# EAGLE design AetherMesh Test Fixture LGA V1.0 (EAGLE 8.3.1)
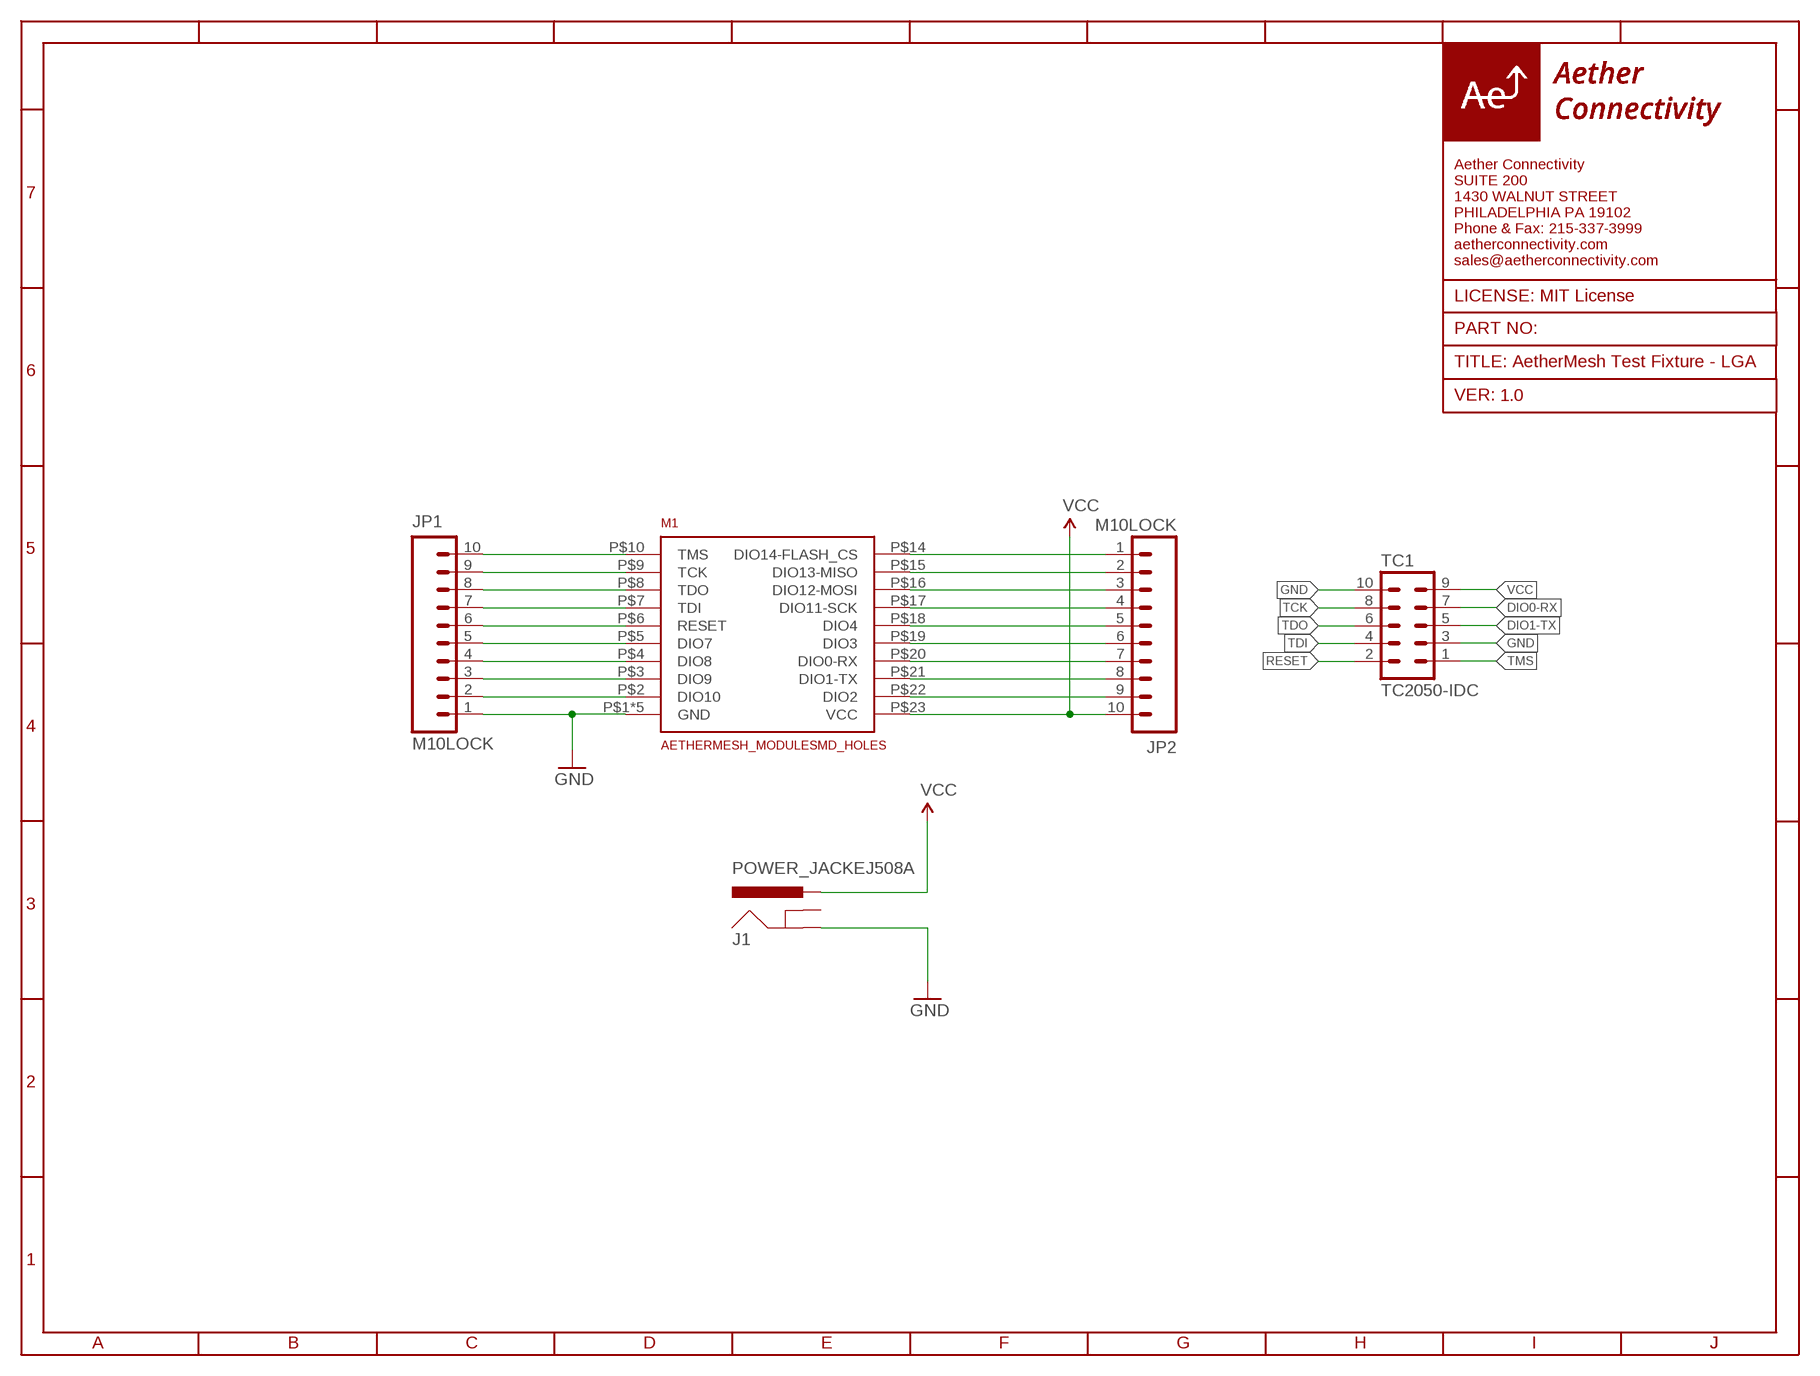
[diagram p0: schematic, sheet 1]

## Parts
J1  POWER_JACKEJ508A  [DC_JACK_EJ508A]
JP1  M10LOCK  [1X10_LOCK]
JP2  M10LOCK  [1X10_LOCK]
M1  AETHERMESH_MODULESMD_HOLES  [AETHERMESH_SMD_MOUNT_HOLES]
TC1  TC2050-IDC  [TC2050-IDC]

## Nets
BUTTON: JP1.2 M1.P$2(DIO10)
CS: JP1.5 M1.P$5(DIO7)
DIO0-RX: JP2.7 M1.P$20(DIO0-RX) TC1.7
DIO1-TX: JP2.8 M1.P$21(DIO1-TX) TC1.5
DIO2: JP2.9 M1.P$22(DIO2)
DIO3: JP2.6 M1.P$19(DIO3)
DIO4: JP2.5 M1.P$18(DIO4)
ENC_RESET: JP1.4 M1.P$4(DIO8)
GND: J1.1(GND) JP1.1 M1.P$1(GND) M1.P$11(GND) M1.P$12(GND) M1.P$13(GND) M1.P$24(GND) TC1.3 TC1.10
INT: JP1.3 M1.P$3(DIO9)
MISO: JP2.2 M1.P$15(DIO13-MISO)
MOSI: JP2.3 M1.P$16(DIO12-MOSI)
N$1: JP2.1 M1.P$14(DIO14-FLASH_CS)
RESET: JP1.6 M1.P$6(RESET) TC1.2
SCK: JP2.4 M1.P$17(DIO11-SCK)
TCK: JP1.9 M1.P$9(TCK) TC1.8
TDI: JP1.7 M1.P$7(TDI) TC1.4
TDO: JP1.8 M1.P$8(TDO) TC1.6
TMS: JP1.10 M1.P$10(TMS) TC1.1
VCC: J1.3(PWR) JP2.10 M1.P$23(VCC) TC1.9
Unconnected: J1.2(GNDBREAK)

## Notes on the sheet
- AetherMesh Test Fixture - LGA
- 1.0

## Library data of the parts
J1 = 3. growflux:POWER_JACK: Power Jack This is the standard 5.5mm barrel jack for power. The PTH is the most common, proven, reliable, footprint. The Slot footprint only works if the mill layer is transmitted to the PCB fab house so be warned. Mating wall wart : TOL-00298 (and others)
JP1 JP2 = 3. growflux:M10: Header 10 Standard 10-pin 0.1" header. Use with straight break away headers (SKU : PRT-00116), right angle break away headers (PRT-00553), swiss pins (PRT-00743), machine pins (PRT-00117), and female headers (PRT-00115).
M1 = AetherConnectivity:AETHERMESH_MODULE
TC1 = TagConnect:TC2050-IDC: Tag-Connect In Circuit Programming & Debug Cable 10 Pin http://www.tag-connect.com

## Board
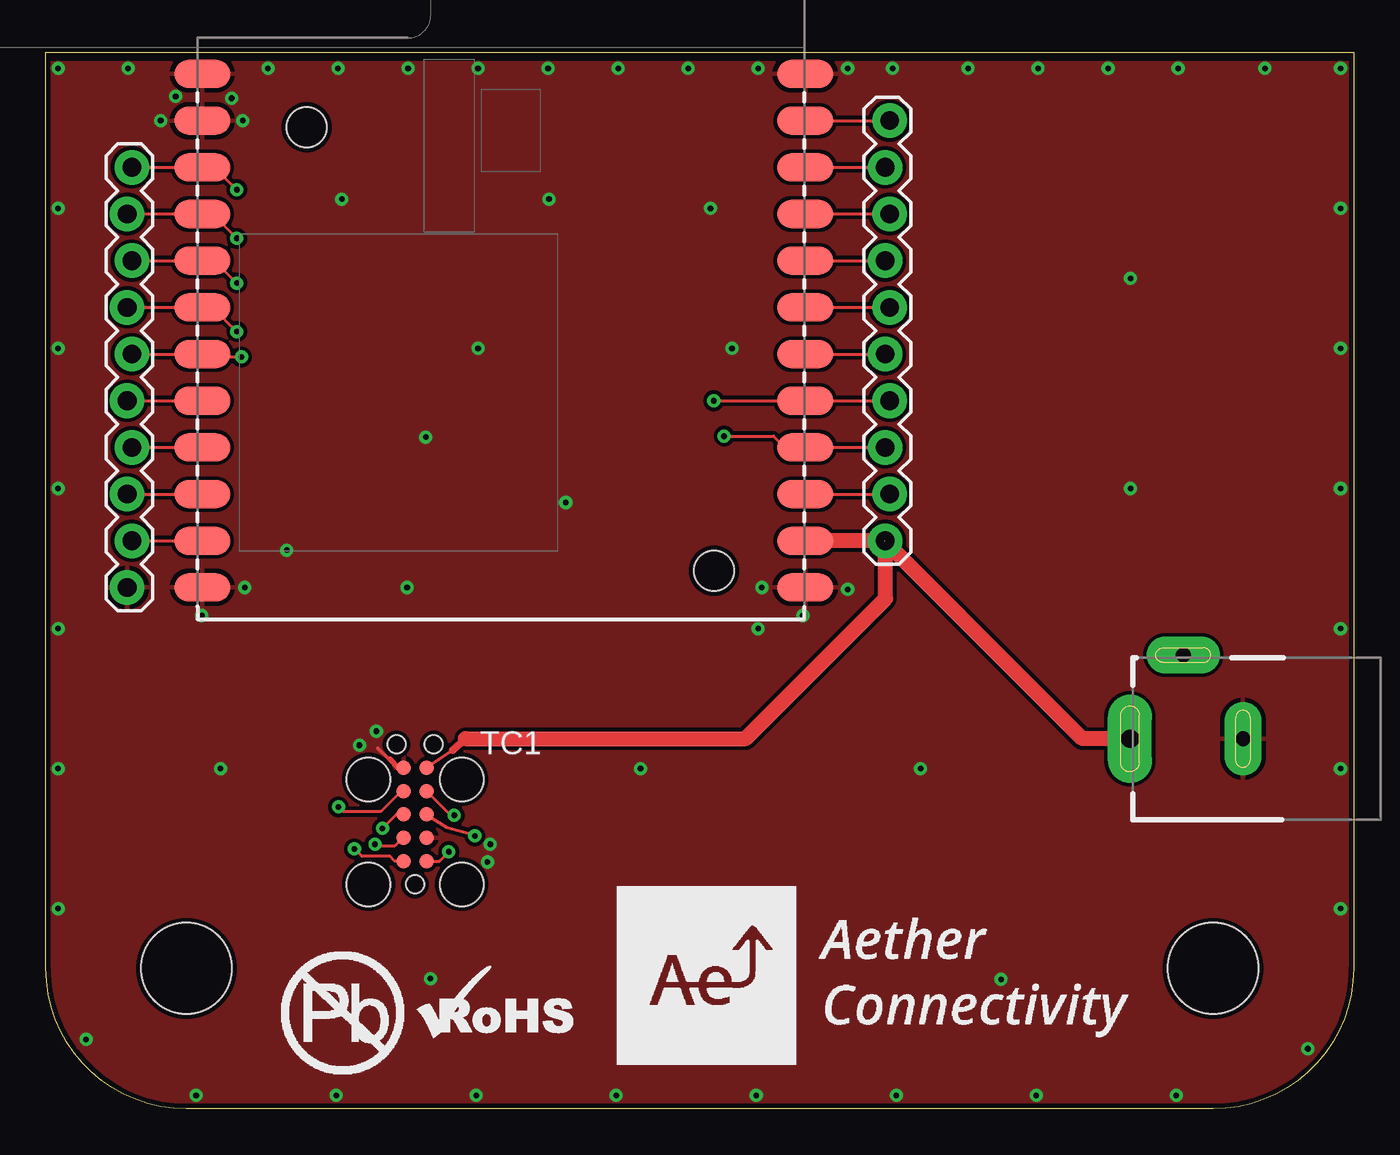
[diagram p1: board, top side]
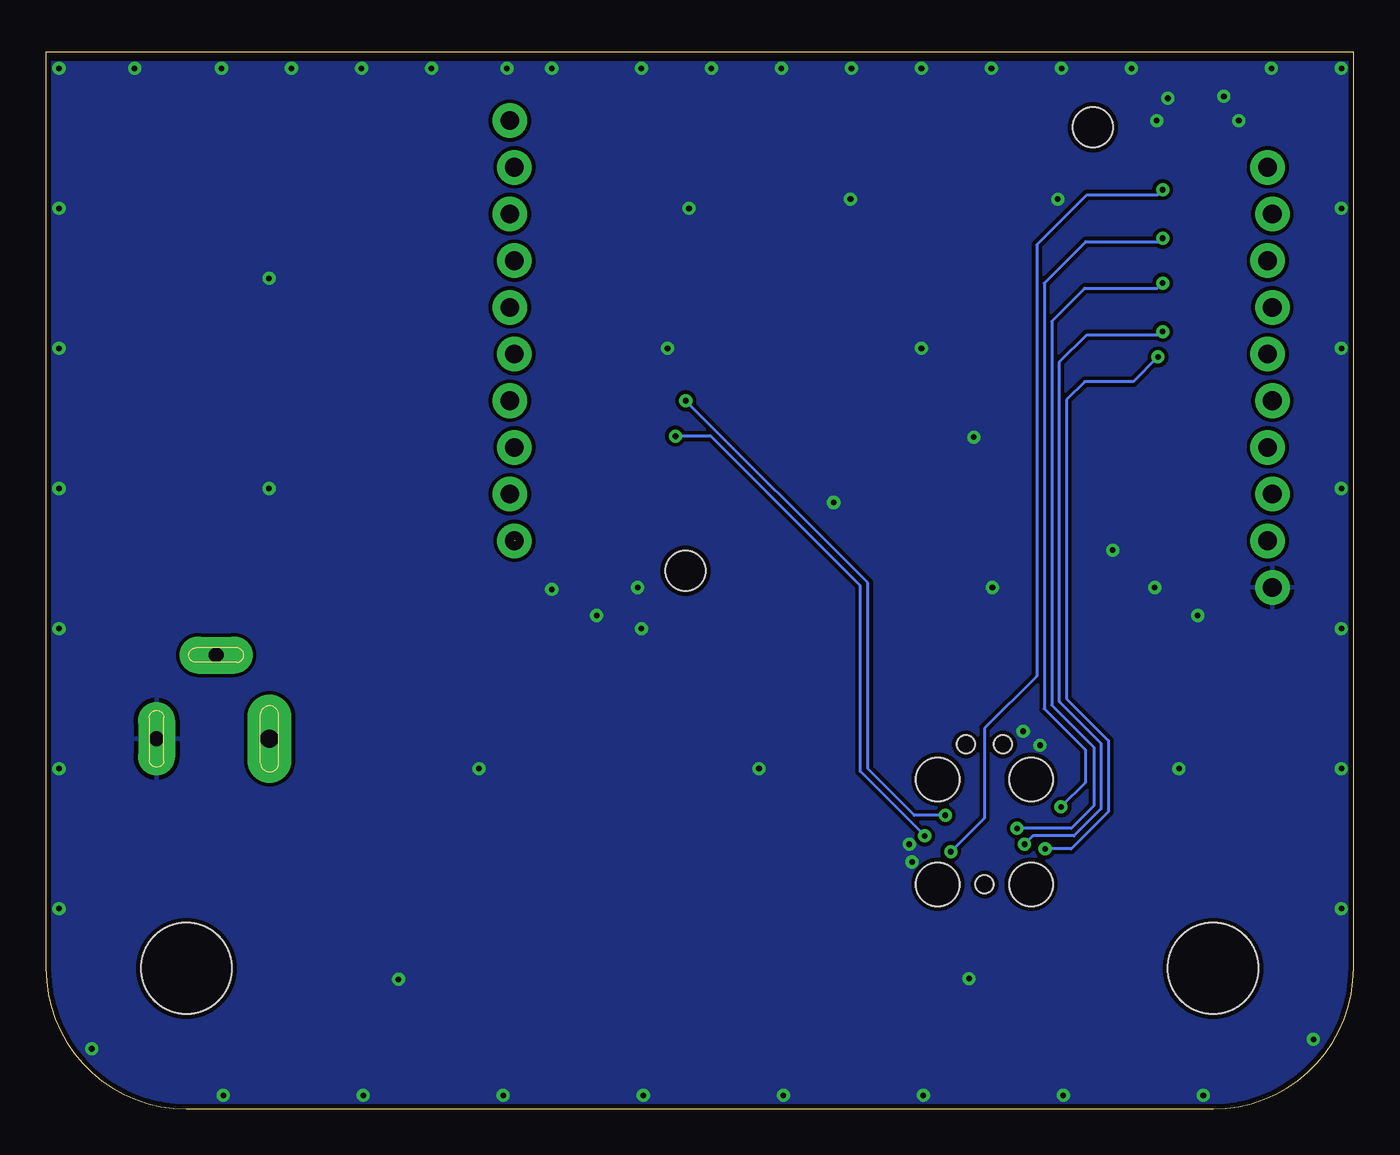
[diagram p2: board, bottom side, seen from below]

Size 71.17 x 57.48 mm. Coordinates in mm from the lower left corner, seen from the top.
Outline: 71.17,7.65 arc-90 63.53,0 7.65,0 arc-90 0,7.65 0,57.48 71.17,57.48 71.17,7.65
Copper layers (1*16): Top 0.035mm / dielectric 1.5mm / Bottom 0.035mm
Design rules "default *": minimum track width 6mil, minimum drill 12mil, track to track 7mil, track to pad 7mil, pad to pad 7mil, via to via 7mil, smd to smd 7mil, copper to edge 10mil, drill to drill 8mil, minimum pad ring 10mil, minimum via ring 8mil, stop-mask expansion 4mil, vias tented up to drill 20mil, thermal gap 10mil
Holes 4.95 mm at 7.65,7.65 63.53,7.65
vRestrict: area 59.4,3.5 to 67.7,11.8; area 3.5,3.5 to 11.8,11.8

### Footprints (pad centres in the part's own frame; a part is rotated, then mirrored left to right if it is on the bottom)
DC_JACK_EJ508A = drill 0.8 pad 2 long: 1 0,0; 2 4.55,3.25 | drill 1 pad 2.4 long: 3 0,6.15
1X10_LOCK = drill 1.016 pad 1.88: 1 0,0.127; 2 2.54,-0.127; 3 5.08,0.127; 4 7.62,-0.127; 5 10.16,0.127; 6 12.7,-0.127; 7 15.24,0.127; 8 17.78,-0.127; 9 20.32,0.127; 10 22.86,-0.127
AETHERMESH_SMD_MOUNT_HOLES = smd 3.048 x 1.524: P$1 0.254,1.727; P$2 0.254,4.267; P$3 0.254,6.807; P$4 0.254,9.347; P$5 0.254,11.887; P$6 0.254,14.427; P$7 0.254,16.967; P$8 0.254,19.507; P$9 0.254,22.047; P$10 0.254,24.587; P$11 0.254,27.127; P$12 0.254,29.667; P$13 33.071,29.667; P$14 33.071,27.127; P$15 33.071,24.587; P$16 33.071,22.047; P$17 33.071,19.507; P$18 33.071,16.967; P$19 33.071,14.427; P$20 33.071,11.887; P$21 33.071,9.347; P$22 33.071,6.807; P$23 33.071,4.267; P$24 33.071,1.727 | hole 2.2: 28.106,2.642; 5.932,26.772
TC2050-IDC = smd 0.787 x 0.787: 1 -2.54,-0.635; 2 -2.54,0.635; 3 -1.27,-0.635; 4 -1.27,0.635; 5 0,-0.635; 6 0,0.635; 7 1.27,-0.635; 8 1.27,0.635; 9 2.54,-0.635; 10 2.54,0.635 | hole 0.991: -3.81,0; 3.81,1.016; 3.81,-1.016 | hole 2.375: -3.81,2.54; -3.81,-2.54; 1.905,2.54; 1.905,-2.54

### Placement (x,y rotation side)
J1  65.15,20.14 90 top
JP1  4.55,28.37 90 top
JP2  45.8,53.77 270 top
M1  8.26,26.64 0 top
TC1  20.09,16.03 90 top

### Tracks (layer width: path | path; a pad name or v marks a point on that pad's centre or on a via)
BUTTON
  Top 0.152: JP1.2 M1.P$2
CS
  Top 0.152: JP1.5 M1.P$5
DIO0-RX  (via drill 0.3)
  Top 0.152: TC1.7 20.73,17.27 22.02,15.98 v22.22,15.98 | v36.35,38.53 M1.P$20 JP2.7
  Bottom 0.152: v22.22,15.98 23.9,15.98 26.44,18.52 26.44,28.63 v36.35,38.53
DIO1-TX  (via drill 0.3)
  Top 0.152: TC1.5 20.73,16 21.82,15.32 23.29,14.91 v23.34,14.86 | v36.91,36.6 39.6,36.6 40.06,36.14 41.17,36.14 M1.P$21 JP2.8
  Bottom 0.152: v23.34,14.86 26.85,18.36 26.85,28.47 34.98,36.6 v36.91,36.6
DIO2
  Top 0.152: M1.P$22 JP2.9
DIO3
  Top 0.152: M1.P$19 JP2.6
DIO4
  Top 0.152: M1.P$18 JP2.5
ENC_RESET
  Top 0.152: JP1.4 M1.P$4
GND  (via drill 0.3)
  Top 0.203: TC1.10 19.18,18.57 | 18.72,19.02 18.67,19.02 18.06,19.63
  Top 0.305: 19.18,18.57 18.72,19.02
  other vias: 10.82,28.37 8.48,26.85 41.2,26.85 38.96,28.37 43.64,28.27 43.64,56.62 46.08,56.62 6.25,53.77 7.06,55.09 10.72,53.77 10.11,54.99 0.66,56.62 0.66,49 0.66,41.38 0.66,33.76 0.66,10.9 8.18,0.74 15.9,56.62 23.52,56.62 31.14,56.62 38.76,56.62 54,56.62 61.62,56.62 70.46,56.62 19.71,56.62 27.33,56.62 34.95,56.62 50.19,56.62 57.81,56.62 66.34,56.62 4.47,56.62 12.09,56.62 15.8,0.74 23.42,0.74 38.66,0.74 61.52,0.74 70.46,41.38 70.46,33.76 70.46,26.14 70.46,10.9 16.1,49.5 27.38,49.5 13.11,30.4 23.52,41.38 28.3,32.99 37.34,41.38 38.76,26.14 19.66,28.37 20.68,36.55 17.07,19.79 17.98,20.55 24.03,13.44 24.18,14.4 0.66,26.14 0.66,18.52 31.04,0.74 46.28,0.74 53.9,0.74 70.46,18.52 70.46,49 59.03,45.19 59.03,33.76 47.6,18.52 32.36,18.52 9.5,18.52 51.98,7.05 20.93,7.09 36.17,49 2.18,3.78 68.68,3.28
  pour Bottom (isolate 0.203, rank 2): 0.28,56.92 0.28,7.9 arc90 7.9,0.28 63.53,0.28 arc90 70.89,7.65 70.89,56.92
  pour Top (isolate 0.203, rank 2): 0.28,56.92 0.28,7.9 arc90 7.9,0.28 63.53,0.28 arc90 70.89,7.65 70.89,56.92
INT
  Top 0.152: JP1.3 M1.P$3
MISO
  Top 0.152: M1.P$15 JP2.2
MOSI
  Top 0.152: M1.P$16 JP2.3
N$1
  Top 0.152: M1.P$14 JP2.1
RESET  (via drill 0.3)
  Top 0.152: v10.64,40.92 9.47,40.92 9.47,41.07 8.52,41.07 M1.P$6 JP1.6 | TC1.2 18.97,13.49 18.72,13.74 17.2,13.74 v16.79,14.15
  Bottom 0.152: v10.64,40.92 11.99,39.57 14.63,39.57 15.62,38.58 15.62,22.33 13.33,20.04 13.33,16.18 15.37,14.15 v16.79,14.15
SCK
  Top 0.152: 41.68,46.15 M1.P$17 JP2.4
TCK  (via drill 0.3)
  Top 0.152: v10.39,47.37 9.07,48.69 M1.P$9 JP1.9 | 19.33,17.3 18.21,16.18 16.18,16.18 v15.93,16.43
  Top 0.203: TC1.8 19.33,17.3
  Bottom 0.152: v15.93,16.43 14.6,17.75 14.6,19.53 16.84,21.77 16.84,44.93 14.58,47.19 10.57,47.19 v10.39,47.37
TDI  (via drill 0.3)
  Top 0.152: v10.39,42.29 9.07,43.61 M1.P$7 JP1.7 | 19.43,14.76 18.97,14.3 18.01,14.3 v17.91,14.4
  Top 0.203: TC1.4 19.43,14.76
  Bottom 0.152: v17.91,14.4 17.45,14.86 15.21,14.86 13.74,16.33 13.74,19.89 16.03,22.17 16.03,40.61 14.53,42.11 10.57,42.11 v10.39,42.29
TDO  (via drill 0.3)
  Top 0.152: v10.39,44.93 9.17,46.15 8.64,46.15 M1.P$8 JP1.8 | 19.08,16.03 v18.31,15.27
  Top 0.203: TC1.6 19.08,16.03
  Bottom 0.152: v18.31,15.27 15.37,15.27 14.15,16.48 14.15,19.69 16.43,21.97 16.43,42.85 14.63,44.65 10.67,44.65 v10.39,44.93
TMS  (via drill 0.3)
  Top 0.152: v10.39,50.01 9.17,51.23 8.7,51.23 M1.P$10 JP1.10 | TC1.1 21.41,13.49 v21.92,14
  Bottom 0.152: v21.92,14 20.09,15.82 20.09,20.7 17.25,23.55 17.25,47.02 14.53,49.73 10.67,49.73 v10.39,50.01
VCC  (1 unrouted)
  Top 0.152: TC1.9 22.12,19.51
  Top 0.406: 22.12,19.51 22.83,20.14
  Top 0.813: J1.3 56.41,20.14 45.69,30.86 | M1.P$23 45.64,30.91 45.69,30.86 | 22.83,20.14 38.07,20.14 45.69,27.76 45.69,30.86